# Altium schematic sheet MAIN.SchDoc
size A4
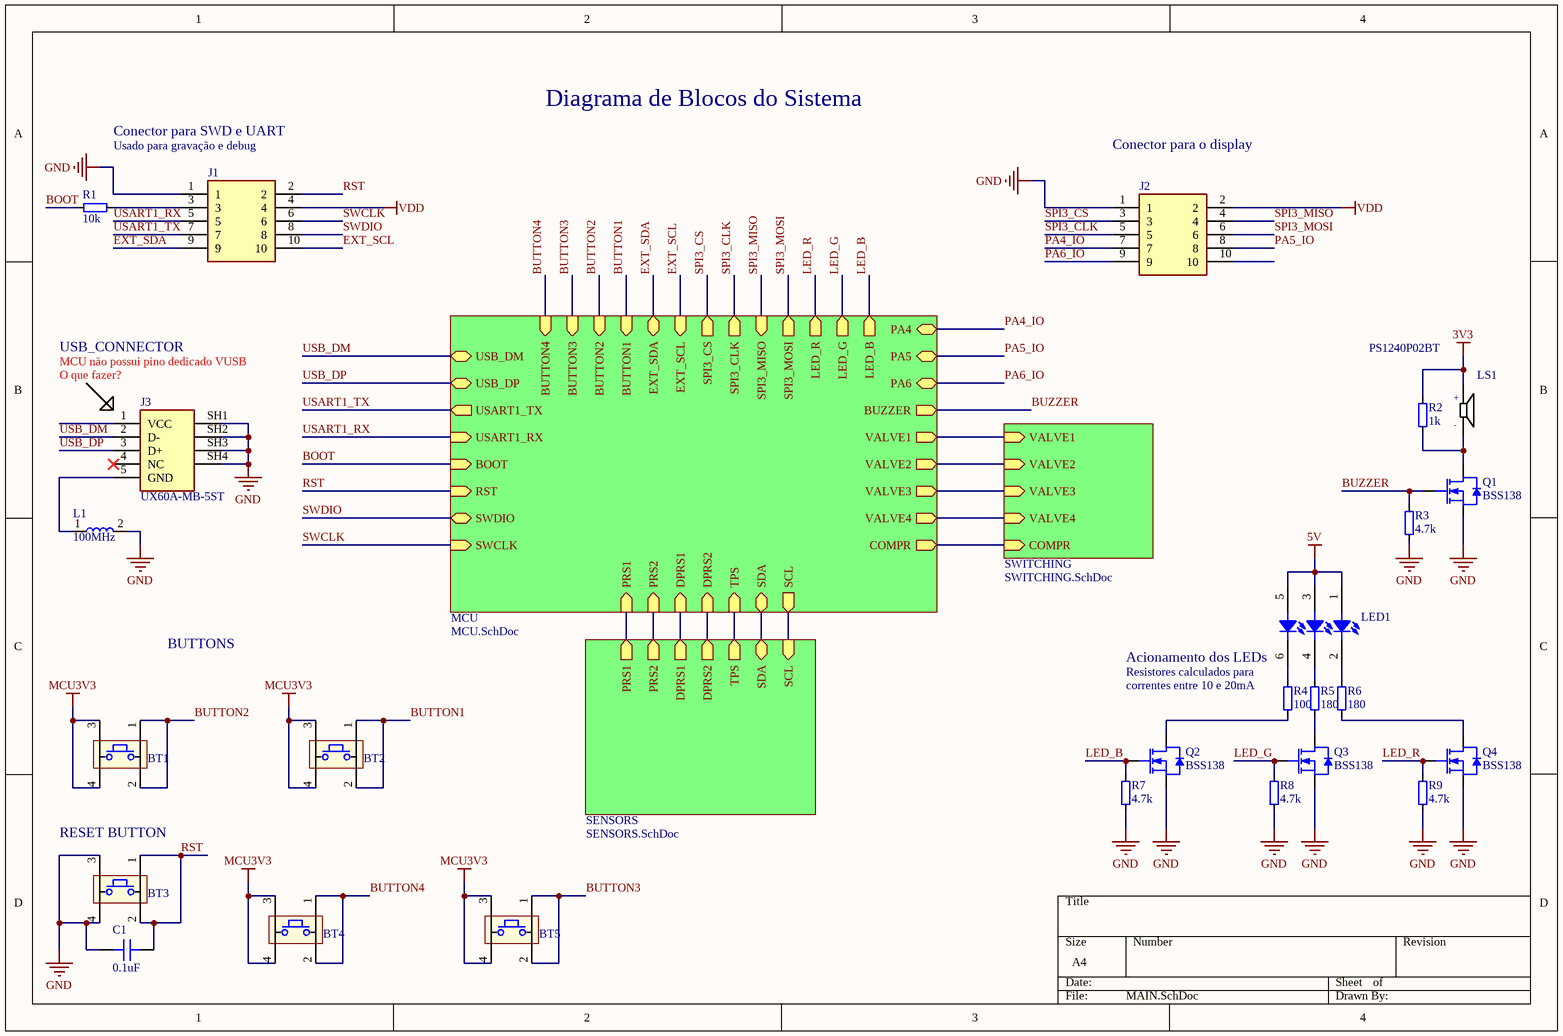
[diagram p0: MAIN.SchDoc]

## Parts
BT1  PTS645SH50SMTR92LFS  [BUTTON_TACTILE_6x6mm]  (value not drawn)
BT2  PTS645SH50SMTR92LFS  [BUTTON_TACTILE_6x6mm]  (value not drawn)
BT3  PTS645SH50SMTR92LFS  [BUTTON_TACTILE_6x6mm]  (value not drawn)
BT4  PTS645SH50SMTR92LFS  [BUTTON_TACTILE_6x6mm]  (value not drawn)
BT5  PTS645SH50SMTR92LFS  [BUTTON_TACTILE_6x6mm]  (value not drawn)
C1  0.1uF  [C_0805]
J1  HEADER_5X2_2.54mm  [HEADER_5X2_2.54mm]  (value not drawn)
J2  HEADER_5X2_2.54mm  [HEADER_5X2_2.54mm]  (value not drawn)
J3  UX60A-MB-5ST  [USB_CONN_SMT]
L1  100MHz  [L_0603]
LED1  ASMB-UTF0-0D20B  [LED_ASMB-UTF0-0D20B]  (value not drawn)
LS1  PS1240P02BT  [BUZZER_THT]
Q1  BSS138  [SOT-23]
Q2  BSS138  [SOT-23]
Q3  BSS138  [SOT-23]
Q4  BSS138  [SOT-23]
R1  10k  [R_0805]
R2  1k  [R_0805]
R3  4.7k  [R_0805]
R4  100  [R_0805]
R5  180  [R_0805]
R6  180  [R_0805]
R7  4.7k  [R_0805]
R8  4.7k  [R_0805]
R9  4.7k  [R_0805]

## Sub-sheets
MCU = MCU.SchDoc: VALVE1 (out), VALVE2 (out), VALVE3 (out), VALVE4 (out), COMPR (out), PRS1 (in), PRS2 (in), DPRS1 (in), DPRS2 (in), TPS (in), SDA (bidir), SCL (out), USART1_RX (in), BOOT (in), RST (in), SWDIO (bidir), SWCLK (in), USART1_TX (out), EXT_SDA (bidir), EXT_SCL (in), SPI3_CS (out), SPI3_CLK (out), SPI3_MISO (in), SPI3_MOSI (out), LED_R (out), LED_G (out), LED_B (out), BUZZER (out), BUTTON1 (in), BUTTON2 (in), BUTTON3 (in), BUTTON4 (in), USB_DP (bidir), USB_DM (bidir), PA5, PA6, PA4
SENSORS = SENSORS.SchDoc: PRS1 (out), PRS2 (out), DPRS1 (out), DPRS2 (out), SDA (bidir), TPS (out), SCL (in)
SWITCHING = SWITCHING.SchDoc: VALVE1 (in), VALVE2 (in), VALVE3 (in), VALVE4 (in), COMPR (in)

## Nets
3V3: LS1.1 R2.2
5V: LED1.1(RA) LED1.3(GA) LED1.5(BA)
GND: BT3.3 BT3.4 C1.1 J1.1 J2.1 J3.SH1 J3.SH2 J3.SH3 J3.SH4 L1.2 Q1.2(S) Q2.2(S) Q3.2(S) Q4.2(S) R3.1 R7.1 R8.1 R9.1
MCU3V3: BT1.3 BT1.4 BT2.3 BT2.4 BT4.3 BT4.4 BT5.3 BT5.4
VDD: J1.4 J2.2
BOOT: R1.2 ; sheet MCU/BOOT
BUTTON1: BT2.1 BT2.2 ; sheet MCU/BUTTON1
BUTTON2: BT1.1 BT1.2 ; sheet MCU/BUTTON2
BUTTON3: BT5.1 BT5.2 ; sheet MCU/BUTTON3
BUTTON4: BT4.1 BT4.2 ; sheet MCU/BUTTON4
BUZZER: Q1.1(G) R3.2 ; sheet MCU/BUZZER
EXT_SCL: J1.10 ; sheet MCU/EXT_SCL
EXT_SDA: J1.9 ; sheet MCU/EXT_SDA
LED_B: Q2.1(G) R7.2 ; sheet MCU/LED_B
LED_G: Q3.1(G) R8.2 ; sheet MCU/LED_G
LED_R: Q4.1(G) R9.2 ; sheet MCU/LED_R
PA4_IO: J2.7 ; sheet MCU/PA4
PA5_IO: J2.8 ; sheet MCU/PA5
PA6_IO: J2.9 ; sheet MCU/PA6
RST: BT3.1 BT3.2 C1.2 J1.2 ; sheet MCU/RST
SPI3_CLK: J2.5 ; sheet MCU/SPI3_CLK
SPI3_CS: J2.3 ; sheet MCU/SPI3_CS
SPI3_MISO: J2.4 ; sheet MCU/SPI3_MISO
SPI3_MOSI: J2.6 ; sheet MCU/SPI3_MOSI
SWCLK: J1.6 ; sheet MCU/SWCLK
SWDIO: J1.8 ; sheet MCU/SWDIO
USART1_RX: J1.5 ; sheet MCU/USART1_RX
USART1_TX: J1.7 ; sheet MCU/USART1_TX
USB_DM: J3.2(D-) ; sheet MCU/USB_DM
USB_DP: J3.3(D+) ; sheet MCU/USB_DP
NetJ1_3: J1.3 R1.1
NetJ3_5: J3.5(GND) L1.1
NetLED1_2: LED1.2(RC) R6.2
NetLED1_4: LED1.4(GC) R5.2
NetLED1_6: LED1.6(BC) R4.2
NetLS1_2: LS1.2 Q1.3(D) R2.1
NetQ2_3: Q2.3(D) R4.1
NetQ3_3: Q3.3(D) R5.1
NetQ4_3: Q4.3(D) R6.1
(unnamed): sheet MCU/VALVE1, sheet SWITCHING/VALVE1
(unnamed): sheet MCU/VALVE2, sheet SWITCHING/VALVE2
(unnamed): sheet MCU/VALVE3, sheet SWITCHING/VALVE3
(unnamed): sheet MCU/VALVE4, sheet SWITCHING/VALVE4
(unnamed): sheet MCU/COMPR, sheet SWITCHING/COMPR
(unnamed): sheet MCU/PRS1, sheet SENSORS/PRS1
(unnamed): sheet MCU/PRS2, sheet SENSORS/PRS2
(unnamed): sheet MCU/DPRS1, sheet SENSORS/DPRS1
(unnamed): sheet MCU/DPRS2, sheet SENSORS/DPRS2
(unnamed): sheet MCU/TPS, sheet SENSORS/TPS
(unnamed): sheet MCU/SDA, sheet SENSORS/SDA
(unnamed): sheet MCU/SCL, sheet SENSORS/SCL

Not connected (* = marked no-connect by the designer): J2 10; J3 1(VCC) 4(NC)*

## Notes on the sheet
- Diagrama de Blocos do Sistema
- Conector para SWD e UART
- Usado para gravação e debug
- Conector para o display
- USB_CONNECTOR
- MCU não possui pino dedicado VUSB
- (near J3) O que fazer?
- BUTTONS
- Acionamento dos LEDs
- (near R4) Resistores calculados para
- (near R4) correntes entre 10 e 20mA
- (near BT3) RESET BUTTON
- (in symbol BUZZER_PS1240P02BT) +; -

## Library data of the parts
BT1-BT5 = BUTTON_TACTICAL: Tactile Switches SWITCH TACTILE; Part Number: PTS645SH50SMTR92LFS; Datasheet: https://www.mouser.in/datasheet/2/60/pts645-1382776.pdf; Supplier: https://www.mouser.in/ProductDetail/CK/PTS645SH50SMTR92LFS?qs=FESYatJ8odJq4YGoPOs%2Fjw==
C1 = C_0805_C0805C104K5RAC7411: SMD/SMT 50V 0.1uF X7R 0805 10% Ceramic; Manufacturer: KEMET; Value: 0.1uF; Voltage: 50V; Datasheet: https://www.mouser.in/datasheet/2/212/KEM_C1002_X7R_SMD-1102033.pdf; Supplier: https://www.mouser.in/ProductDetail/KEMET/C0805C104K5RAC7411?qs=sGAEpiMZZMukHu%252BjC5l7YUy%2FB4dg%2FhTABr7B0xlsxU8%3D; Temperature: -55 to +125ºC; Part Number: C0805C104K5RAC7411
J1 J2 = HEADER_5X2_2.54mm: Headers & Wire Housings 10 POSITION DBL. ROW; Part Number: 67997-410HLF; Datasheet: https://www.amphenol-icc.com/media/wysiwyg/files/documentation/datasheet/boardwiretoboard/bwb_bergstik.pdf; Supplier: https://www.mouser.in/ProductDetail/Amphenol-FCI/67997-410HLF?qs=sGAEpiMZZMsMLZWdhVL71zU2Dhk42U5G
J3 = USB_CONN_UX60A-MB-5ST: USB Connector UX60A-MB-5ST; Height: 4mm; Datasheet: https://media.digikey.com/pdf/Data%20Sheets/Hirose%20PDFs/UX%20Series.pdf; Supplier: https://www.mouser.in/ProductDetail/Hirose-Connector/UX60A-MB-5ST?qs=XQjbzJWzFPVU%252BTtGLEiQTQ==; Part Number: UX60A-MB-5ST
L1 = L_0603_BKP1608HS271-T: FERRITE BEAD 270 OHM 0603; Value: 100MHz; Datasheet: https://www.mouser.in/datasheet/2/396/mlci08_e-1396622.pdf; Supplier: https://www.mouser.in/ProductDetail/Taiyo-Yuden/BKP1608HS271-T?qs=I6KAKw0tg2zbDi4vUs5b8A==
LED1 = LED_ASMB-UTF0-0D20B: SMD 2828 Tricolor PLCC6 LEDs; Forward Voltage: 2.1V; Forward Current: 25mA; Datasheet: https://docs.broadcom.com/doc/ASMB-UTF0-0D20B-DS100; Supplier: https://www.mouser.in/ProductDetail/Broadcom/ASMB-UTF0-0D20B?qs=sGAEpiMZZMtilyJihmhKq2AQS22fZSBSgD7nbSPNdwMclln52G2Icg%3D%3D; Part Number: ASMB-UTF0-0D20B
LS1 = BUZZER_PS1240P02BT: Piezo Buzzer Round 12.2mmx6.5mm 4kHz Vin=3V; Value: 4kHz; Part Number: PS1240P02BT; Datasheet: https://br.mouser.com/datasheet/2/400/iezoelectronic_buzzer_ps_en-1131915.pdf; Supplier: https://br.mouser.com/ProductDetail/TDK/PS1240P02BT?qs=sGAEpiMZZMsK322k1rNFfYfXmCWsjkB8iQfg2vl062k%3D
Q1-Q4 = BSS138: MOSFET SOT-23 N-CH LOGIC; Part Number: BSS138; Datasheet: https://br.mouser.com/datasheet/2/308/BSS138-D-1658842.pdf; Supplier: https://br.mouser.com/ProductDetail/ON-Semiconductor-Fairchild/BSS138?qs=sGAEpiMZZMshyDBzk1%2FWi1qxDdW%2FXBi2IwQV99jpxW8%3D
R1 = R_0805_ERJ-6GEYJ103V: RES 10K OHM 1/8W 5% 0805 SMD; Manufacturer: Panasonic - ECG; Voltage: 150V; Value: 10k; Supplier: https://www.mouser.in/ProductDetail/Panasonic/ERJ-6GEYJ103V?qs=tQNqqtTOejK5rw%252BRxJVxUA==; Datasheet: https://www.mouser.in/datasheet/2/315/AOA0000C301-1488782.pdf; Temperature: -55 to +155ºC; Part Number: ERJ-6GEYJ103V
R2 = R_0805_ERJ-6GEYJ102V: SMD 0805 1K OHM 5% AEC-Q200; Manufacturer: Panasonic - ECG; Value: 1k; Supplier: https://br.mouser.com/ProductDetail/Panasonic/ERJ-6GEYJ102V?qs=%2Fha2pyFaduiXHwl36i8QX1Is8RUpW4zS7XPMZn%2FLDmVYYw7P67RQlQ%3D%3D; Datasheet: https://br.mouser.com/datasheet/2/315/AOA0000C301-1488782.pdf; Temperature: -55 to +155ºC; Part Number: ERJ-6GEYJ102V
R3 R7-R9 = R_0805_ERJ-6GEYJ472V: SMD 0805 4.7K OHM 5% AEC-Q200 Thick Film; Manufacturer: Panasonic; Voltage: 150V; Value: 4.7k; Supplier: https://www.mouser.in/ProductDetail/Panasonic/ERJ-6GEYJ472V?qs=tQNqqtTOejJz%2FGQTI2SwEA==; Datasheet: https://www.mouser.in/datasheet/2/315/AOA0000C301-1488782.pdf; Temperature: -55 to +155ºC; Part Number: ERJ-6GEYJ472V
R4 = R_0805_ERJ-6GEYJ101V: SMD 0805 100 OHM 5% AEC-Q200 1/8 W; Manufacturer: Panasonic - ECG; Value: 100; Supplier: https://www.mouser.in/ProductDetail/Panasonic/ERJ-6GEYJ101V?qs=%2Fha2pyFaduiXHwl36i8QX1f35tjxZRQaem8SvM77FOq%252B6pZFta5%2F9g%3D%3D; Datasheet: https://www.mouser.in/datasheet/2/315/AOA0000C301-1488782.pdf; Temperature: -55 to +155ºC; Part Number: ERJ-6GEYJ101V
R5 R6 = R_0805_ERJ-6GEYJ181V: RES 180 OHM 1/8W 1% 0805 SMD; Manufacturer: Panasonic - ECG; Value: 180; Supplier: https://br.mouser.com/ProductDetail/Panasonic/ERJ-6GEYJ181V?qs=8%252BG0TiN%2FgVrt6v%2F%2FVOHUqg%3D%3D; Datasheet: https://br.mouser.com/datasheet/2/315/AOA0000C301-1488782.pdf; Temperature: -55 to +155ºC; Part Number: ERJ-6GEYJ181V